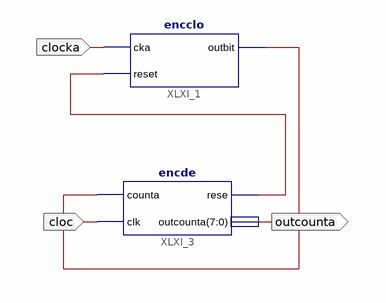
[diagram p0: schematic sheet 1]
// Xilinx ISE schematic encoderfinal.sch (spartan6) as structural Verilog: 2 symbols, 3 ports
module encoderfinal (
  input  clocka,
  input  cloc,
  output outcounta
);

  wire XLXN_3, XLXN_7;

  encclo XLXI_1 (.cka(clocka), .reset(XLXN_7), .outbit(XLXN_3));
  encde XLXI_3 (.counta(XLXN_3), .clk(cloc), .rese(XLXN_7), .outcounta({8{outcounta}}));
endmodule
